# EAGLE schematic Indome Ekow Annan 3031820 (EAGLE 9.6.2)
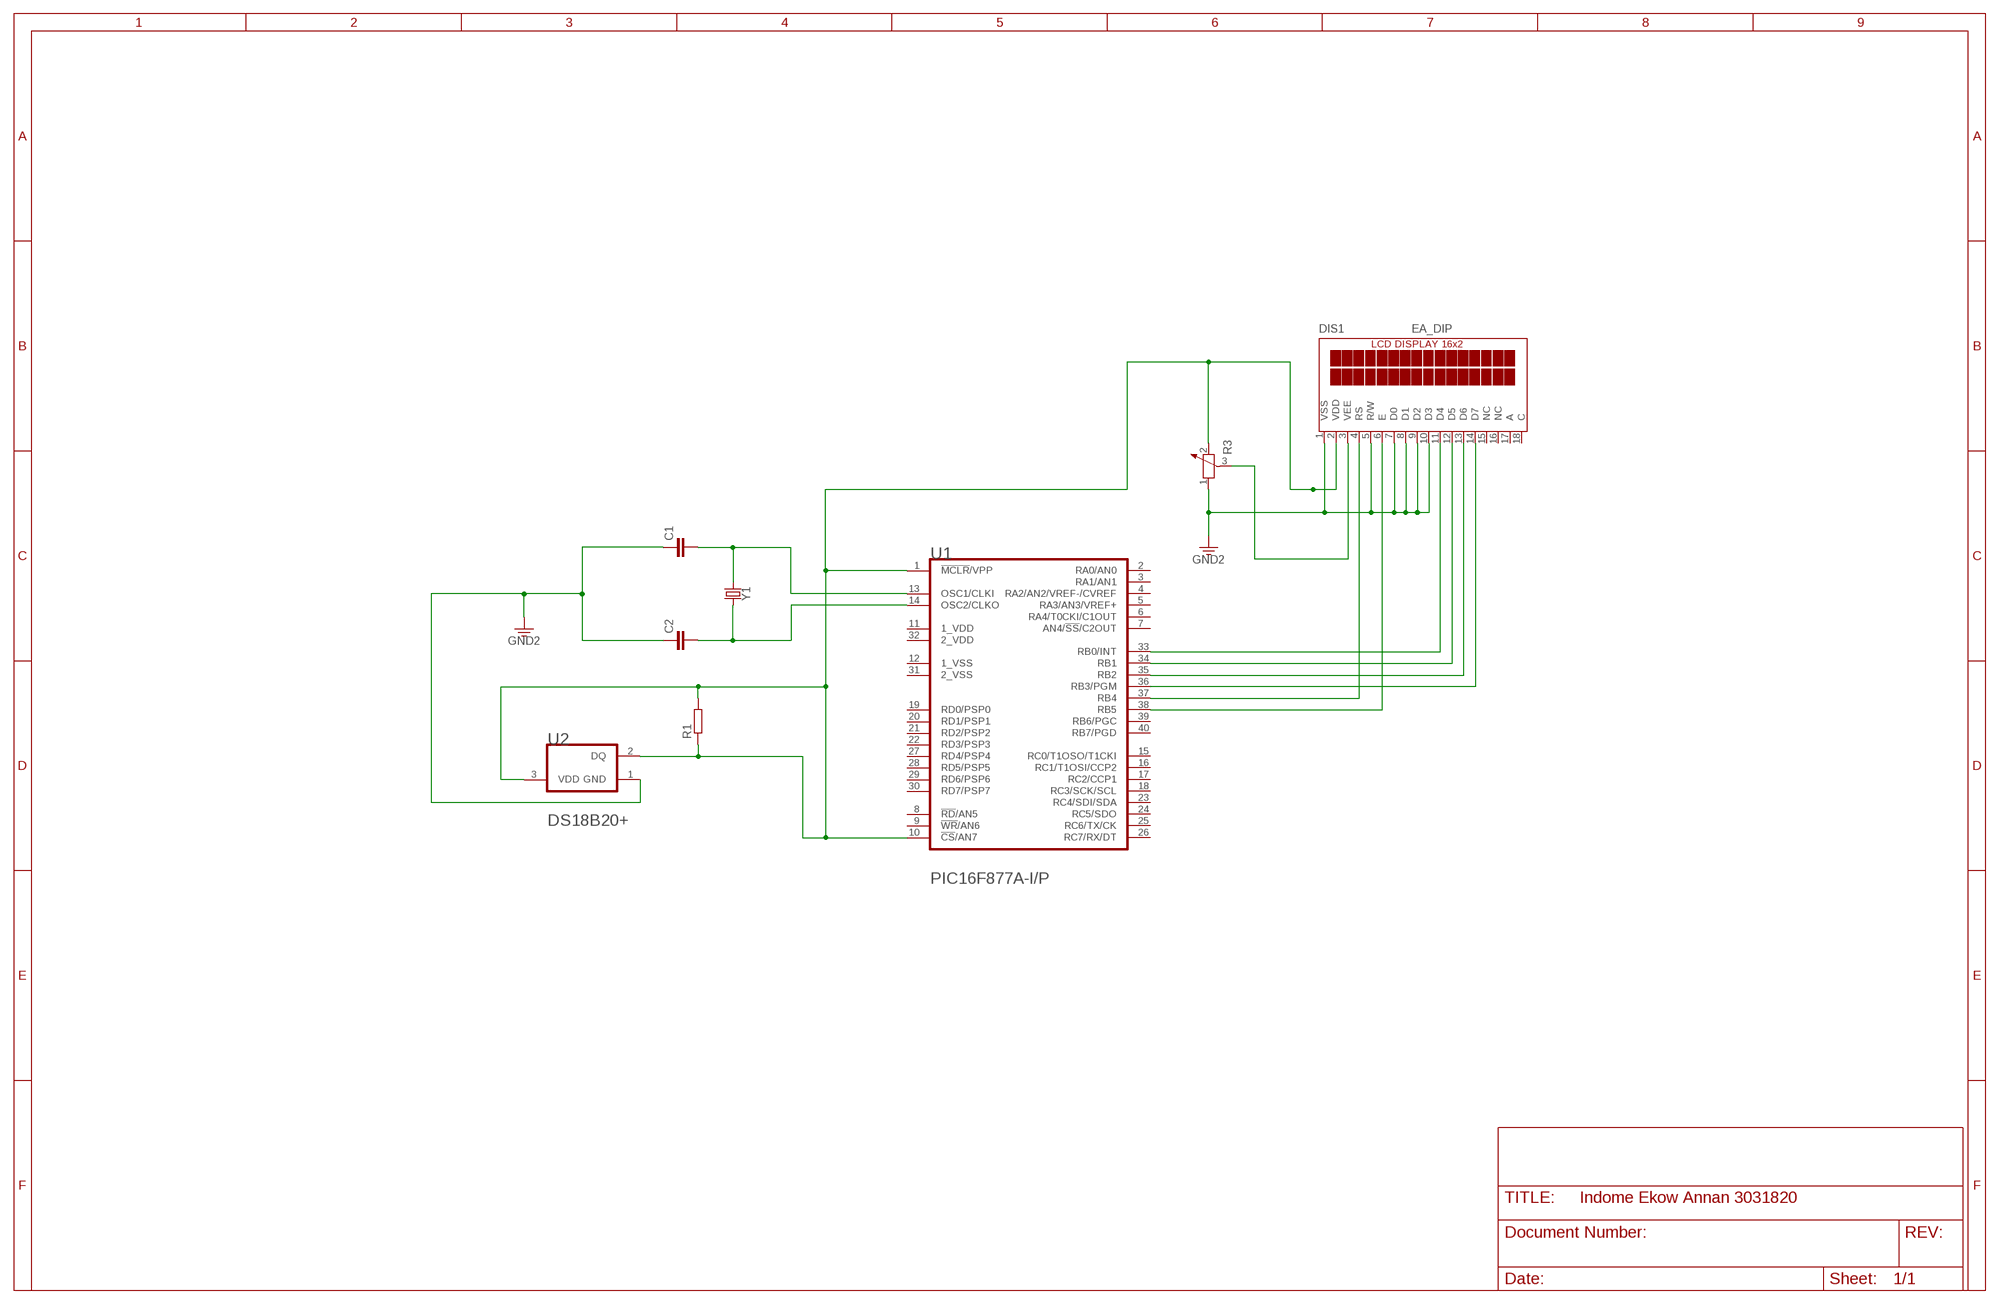
[diagram p0: schematic, sheet 1]

## Parts
C1  C2,5-3  [C2.5-3]
C2  C2,5-3  [C2.5-3]
DIS1  EA_DIP  [EA_DIP]
R1  R-EU_0204/2V  [0204V]
R3  POTENTIOMETER_PT-10  [PT-10]
U1  MICROCHIP_PIC16F877A-I-PMICROCHIP_PIC16F877A-I-P_0_0  [MICROCHIP_PIC16F877A-I-P_0]
U2  MAXIM_DS18B20+MAXIM_DS18B20+_0_0  [MAXIM_DS18B20+_0]
Y1  CRYSTALPTH-2X6  [CRYSTAL-PTH-2X6-CYL]

## Nets
3.3V: C1.1 C2.1 DIS1.1(VSS) DIS1.5(R/W) DIS1.7(D0) DIS1.8(D1) DIS1.9(D2) DIS1.10(D3) R3.1 U2.1(GND) ; supply symbol labelled GND2
N$1: DIS1.2(VDD) R1.1 R1.2 R3.2 U1.1(!MCLR!/VPP) U1.10(!CS!/AN7) U2.2(DQ) U2.3(VDD)
N$4: DIS1.3(VEE) R3.3
N$5: DIS1.6(E) U1.38(RB5)
N$6: C1.2 U1.13(OSC1/CLKI) Y1.1
N$7: C2.2 U1.14(OSC2/CLKO) Y1.2
N$8: DIS1.4(RS) U1.37(RB4)
N$9: DIS1.11(D4) U1.33(RB0/INT)
N$10: DIS1.12(D5) U1.34(RB1)
N$11: DIS1.13(D6) U1.35(RB2)
N$12: DIS1.14(D7) U1.36(RB3/PGM)
Unconnected: DIS1.15(NC) DIS1.16(NC) DIS1.17(A) DIS1.18(C) U1.2(RA0/AN0) U1.3(RA1/AN1) U1.4(RA2/AN2/VREF-/CVREF) U1.5(RA3/AN3/VREF+) U1.6(RA4/T0CKI/C1OUT) U1.7(AN4/!SS!/C2OUT) U1.8(!RD!/AN5) U1.9(!WR!/AN6) U1.15(RC0/T1OSO/T1CKI) U1.16(RC1/T1OSI/CCP2) U1.17(RC2/CCP1) U1.18(RC3/SCK/SCL) U1.19(RD0/PSP0) U1.20(RD1/PSP1) U1.21(RD2/PSP2) U1.22(RD3/PSP3) U1.23(RC4/SDI/SDA) U1.24(RC5/SDO) U1.25(RC6/TX/CK) U1.26(RC7/RX/DT) U1.27(RD4/PSP4) U1.28(RD5/PSP5) U1.29(RD6/PSP6) U1.30(RD7/PSP7) U1.39(RB6/PGC) U1.40(RB7/PGD)

## Power pins joined to a net without a drawn wire
1_VDD: U1.11(1_VDD)
1_VSS: U1.12(1_VSS)
2_VDD: U1.32(2_VDD)
2_VSS: U1.31(2_VSS)

## Library data of the parts
C1 C2 = capacitor-wima:C: CAPACITOR naming: grid - package width
DIS1 = display-lcd:EA_DIP: LCD-MODUL 2x16 - 6,68mm, INKL. KONTROLLER HD44780 Source: Data sheet <http://www.lcd-module.de/pdf/doma/dip162-d.pdf>
R1 = rcl:R-EU_: RESISTOR, European symbol; SPICEPREFIX: R
R3 = rcl:POTENTIOMETER_: Potentiometer; SPICEMODEL: POT; SPICEPREFIX: X
U1 = PIC6:MICROCHIP_PIC16F877A-I-P: MC-8B-16F874A-IL40; CIIVA_IDS: 2386684; COMPONENT_AVAILABILITY: Unknown. Contact manufacturer to determine status.; DATASHEET_VERSION: revB, Oct-2003; FOOTPRINT_VARIANT_NAME_0: Manufacturer Recommended; IMPORTED: yes; IMPORTED_FROM: vault; IMPORT_TS: 1521867991; MF: Microchip; MPN: PIC16F877A-I/P; PACKAGE: PDIP600-P40; PACKAGE_DESCRIPTION: 40-Lead Plastic Dual In-Line (P) - 600 mil Body [PDIP]; PACKAGE_VERSION: revBB, Aug-2009; PIN_0_0_12_INSIDE_EDGE: clock; PIN_0_0_14_INSIDE_EDGE: clock; PIN_0_0_15_INSIDE_EDGE: clock; PIN_0_0_17_INSIDE_EDGE: clock; PIN_0_0_24_INSIDE_EDGE: clock; PIN_0_0_38_INSIDE_EDGE: clock; PIN_0_0_5_INSIDE_EDGE: clock; PREFIX: U; RELEASE_DATE: 1300248711; VAULT_GUID: 6AD2EAC1-1147-4CED-9B35-F9BF5FCC9991; VAULT_REVISION: 17460CF1-C4B7-4503-A858-33A68A39A169
U2 = Maxim - DS18B20+:MAXIM_DS18B20+: SEN-TEMP-DS1821-SIL3; CODE__JEDEC: TO-226-AA; COMPONENT_LINK_1_DESCRIPTION: Manufacturer URL; COMPONENT_LINK_1_URL: http://www.maxim-ic.com; DATASHEET: http://datasheets.maxim-ic.com/en/ds/DS18B20.pdf; DATASHEET_VERSION: 2007; IMPORTED: yes; IMPORTED_FROM: vault; IMPORT_TS: 1521175214; MF: Maxim; MPN: DS18B20+; PACKAGE: Q3+1; PACKAGE_DESCRIPTION: TO-92 Package, Body Dia. 4.7mm; Leads 0.51 x 0.51 mm (max), Pb-Free; PACKAGE_VERSION: revB, 2009; PREFIX: U; VAULT_GUID: 4DCFAAE3-7A6A-4549-B0EF-1FCEB9571E48; VAULT_REVISION: 4B638EE8-EB5D-4A7C-AF1B-85BB5ADAC3A6
Y1 = SparkFun-Clocks:CRYSTAL: Crystals (Generic) These are passive quartz crystals, which can be used as a clock source for a microcontroller. Crystal's are two-terminal devices. They require external "load" capacitors to generate an oscillating signal.